# EAGLE design Jetson Breakout (EAGLE 8.6.1)
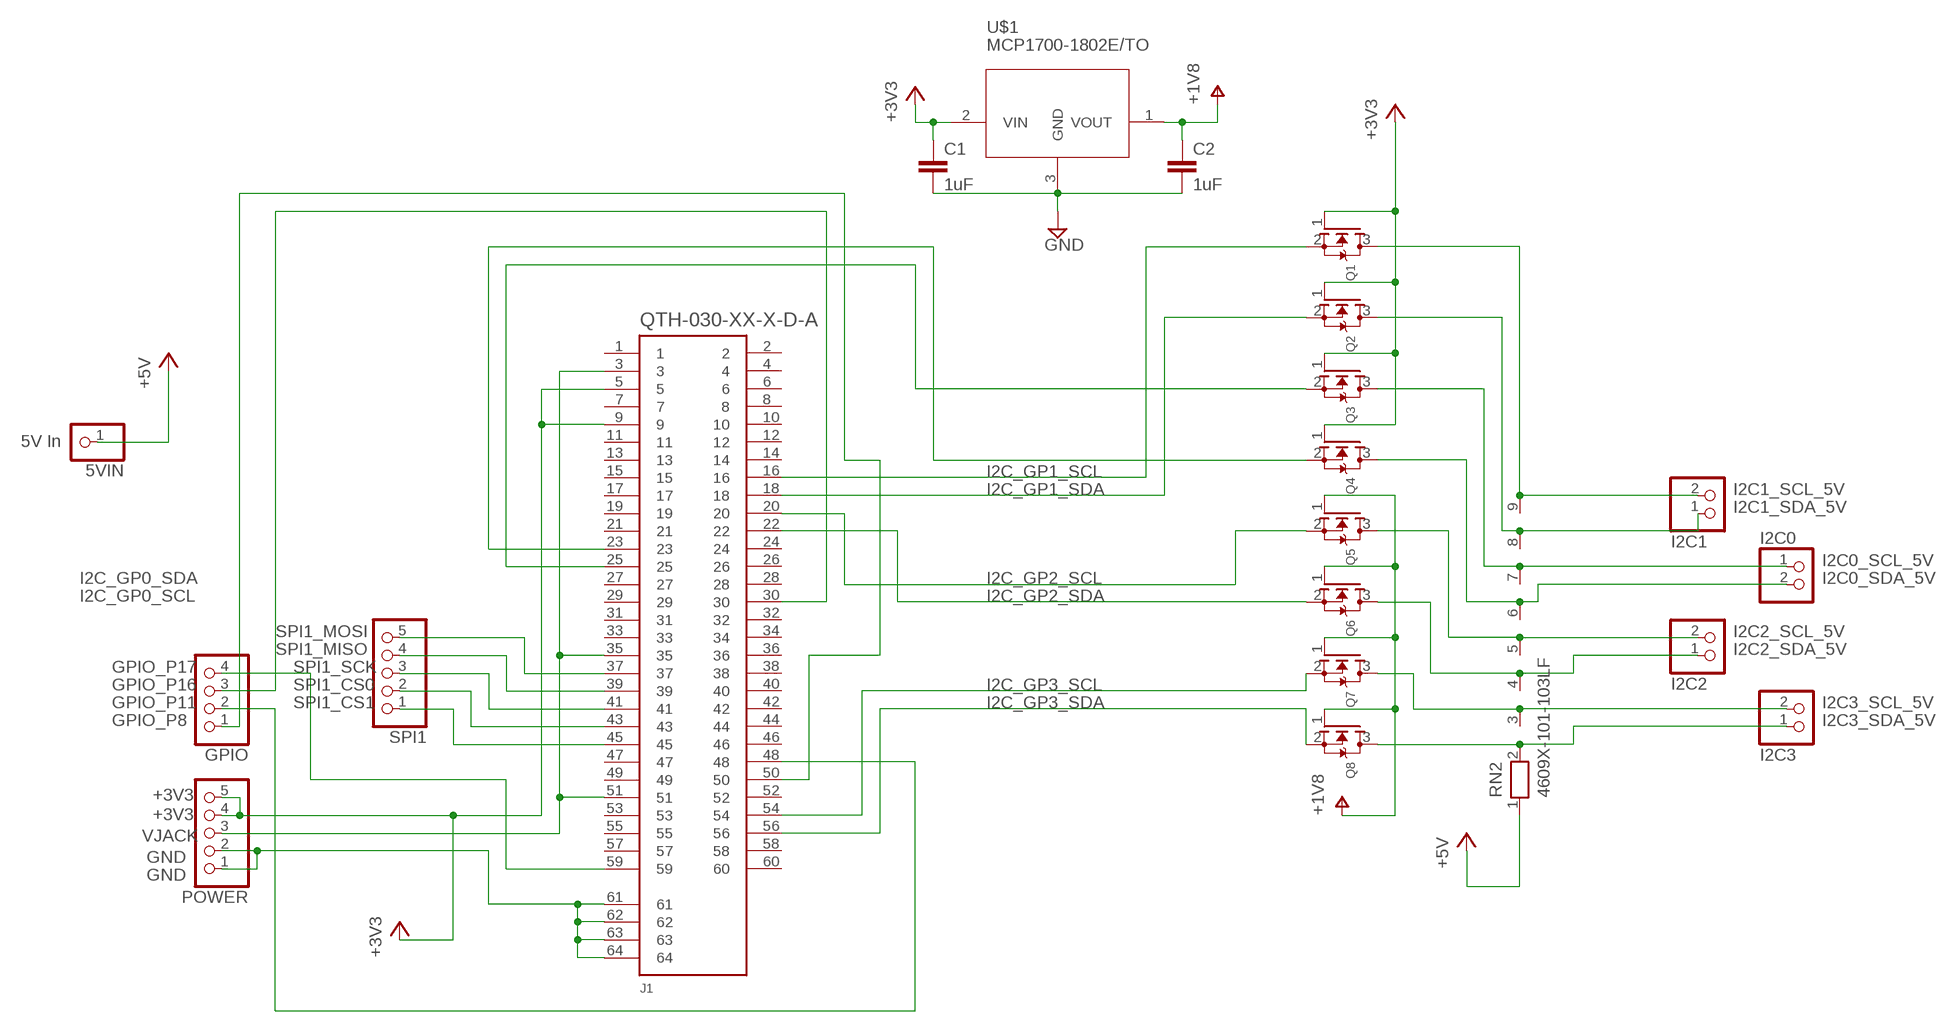
[diagram p0: schematic, sheet 1]

## Parts
5VIN  PINHD-1X1  [1X01]
C1  1uF  C-EU050-025X075  [C050-025X075]
C2  1uF  C-EU050-025X075  [C050-025X075]
GPIO  PINHD-1X4  [1X04]
I2C0  PINHD-1X2  [1X02]
I2C1  PINHD-1X2  [1X02]
I2C2  PINHD-1X2  [1X02]
I2C3  PINHD-1X2  [1X02]
J1  QTH-030-XX-X-D-A  [QTH-030-XX-X-D-A]
POWER  PINHD-1X5  [1X05]
Q1  MOSFET-NREFLOW  [SOT23]
Q2  MOSFET-NREFLOW  [SOT23]
Q3  MOSFET-NREFLOW  [SOT23]
Q4  MOSFET-NREFLOW  [SOT23]
Q5  MOSFET-NREFLOW  [SOT23]
Q6  MOSFET-NREFLOW  [SOT23]
Q7  MOSFET-NREFLOW  [SOT23]
Q8  MOSFET-NREFLOW  [SOT23]
RN2  4609X-101-103LF  RN08  [RN-9]
SPI1  PINHD-1X5  [1X05]
U$1  MCP1700-1802E/TO  [TO92]

## Nets
+1V8: C2.1 Q5.1(G) Q6.1(G) Q7.1(G) Q8.1(G) U$1.1(VOUT)
+3V3: C1.1 J1.5 J1.9 POWER.4 POWER.5 Q1.1(G) Q2.1(G) Q3.1(G) Q4.1(G) U$1.2(VIN)
+5V: 5VIN.1 RN2.1
GND: C1.2 C2.2 J1.61 J1.62 J1.63 J1.64 POWER.1 POWER.2 U$1.3(GND)
GPIO_P8: GPIO.1 J1.50
GPIO_P11: GPIO.2 J1.48
GPIO_P16: GPIO.3 J1.30
GPIO_P17: GPIO.4 J1.59
I2C0_SCL_5V: I2C0.1 Q3.3(D) RN2.7
I2C0_SDA_5V: I2C0.2 Q4.3(D) RN2.6
I2C1_SCL_5V: I2C1.2 Q1.3(D) RN2.9
I2C1_SDA_5V: I2C1.1 Q2.3(D) RN2.8
I2C2_SCL_5V: I2C2.2 Q5.3(D) RN2.5
I2C2_SDA_5V: I2C2.1 Q6.3(D) RN2.4
I2C3_SCL_5V: I2C3.2 Q7.3(D) RN2.3
I2C3_SDA_5V: I2C3.1 Q8.3(D) RN2.2
I2C_GP0_SCL: J1.25 Q3.2(S)
I2C_GP0_SDA: J1.23 Q4.2(S)
I2C_GP1_SCL: J1.16 Q1.2(S)
I2C_GP1_SDA: J1.18 Q2.2(S)
I2C_GP2_SCL: J1.20 Q5.2(S)
I2C_GP2_SDA: J1.22 Q6.2(S)
I2C_GP3_SCL: J1.54 Q7.2(S)
I2C_GP3_SDA: J1.56 Q8.2(S)
SPI1_CS0: J1.43 SPI1.2
SPI1_CS1: J1.45 SPI1.1
SPI1_MISO: J1.39 SPI1.4
SPI1_MOSI: J1.37 SPI1.5
SPI1_SCK: J1.41 SPI1.3
VJACK: J1.3 J1.35 J1.51 POWER.3
Unconnected: J1.1 J1.2 J1.4 J1.6 J1.7 J1.8 J1.10 J1.11 J1.12 J1.13 J1.14 J1.15 J1.17 J1.19 J1.21 J1.24 J1.26 J1.27 J1.28 J1.29 J1.31 J1.32 J1.33 J1.34 J1.36 J1.38 J1.40 J1.42 J1.44 J1.46 J1.47 J1.49 J1.52 J1.53 J1.55 J1.57 J1.58 J1.60

## Notes on the sheet
- 5V In

## Library data of the parts
5VIN = adafruit:PINHD-1X1: Pin header 1x1 for 0.1" spacing With round pins
C1 C2 = rcl:C-EU: CAPACITOR, European symbol; SPICEPREFIX: C
GPIO = pinhead:PINHD-1X4: PIN HEADER
I2C0 I2C1-I2C3 = pinhead:PINHD-1X2: PIN HEADER
J1 = QTH-030-XX-X-D-A:QTH-030-XX-X-D-A: HIGH SPEED TERMINAL STRIP, .5mm PITCH, 60 PINS. MANUFACTURER:SAMTEC.
POWER SPI1 = pinhead:PINHD-1X5: PIN HEADER
Q1-Q8 = adafruit:MOSFET-N: N-Channel Mosfet 2N7002E - 60V 260mA SOT23 [Digikey: 2N7002ET1GOSTR-ND] - REEL BSH103 - 30V 850mA SOT23 [Digikey: 568-5013-1-ND]
RN2 = resistor-net:RN08: RESISTOR NETWORK; OC_FARNELL: unknown; OC_NEWARK: unknown
U$1 = custom:MCP1700-1802E/TO

## Board
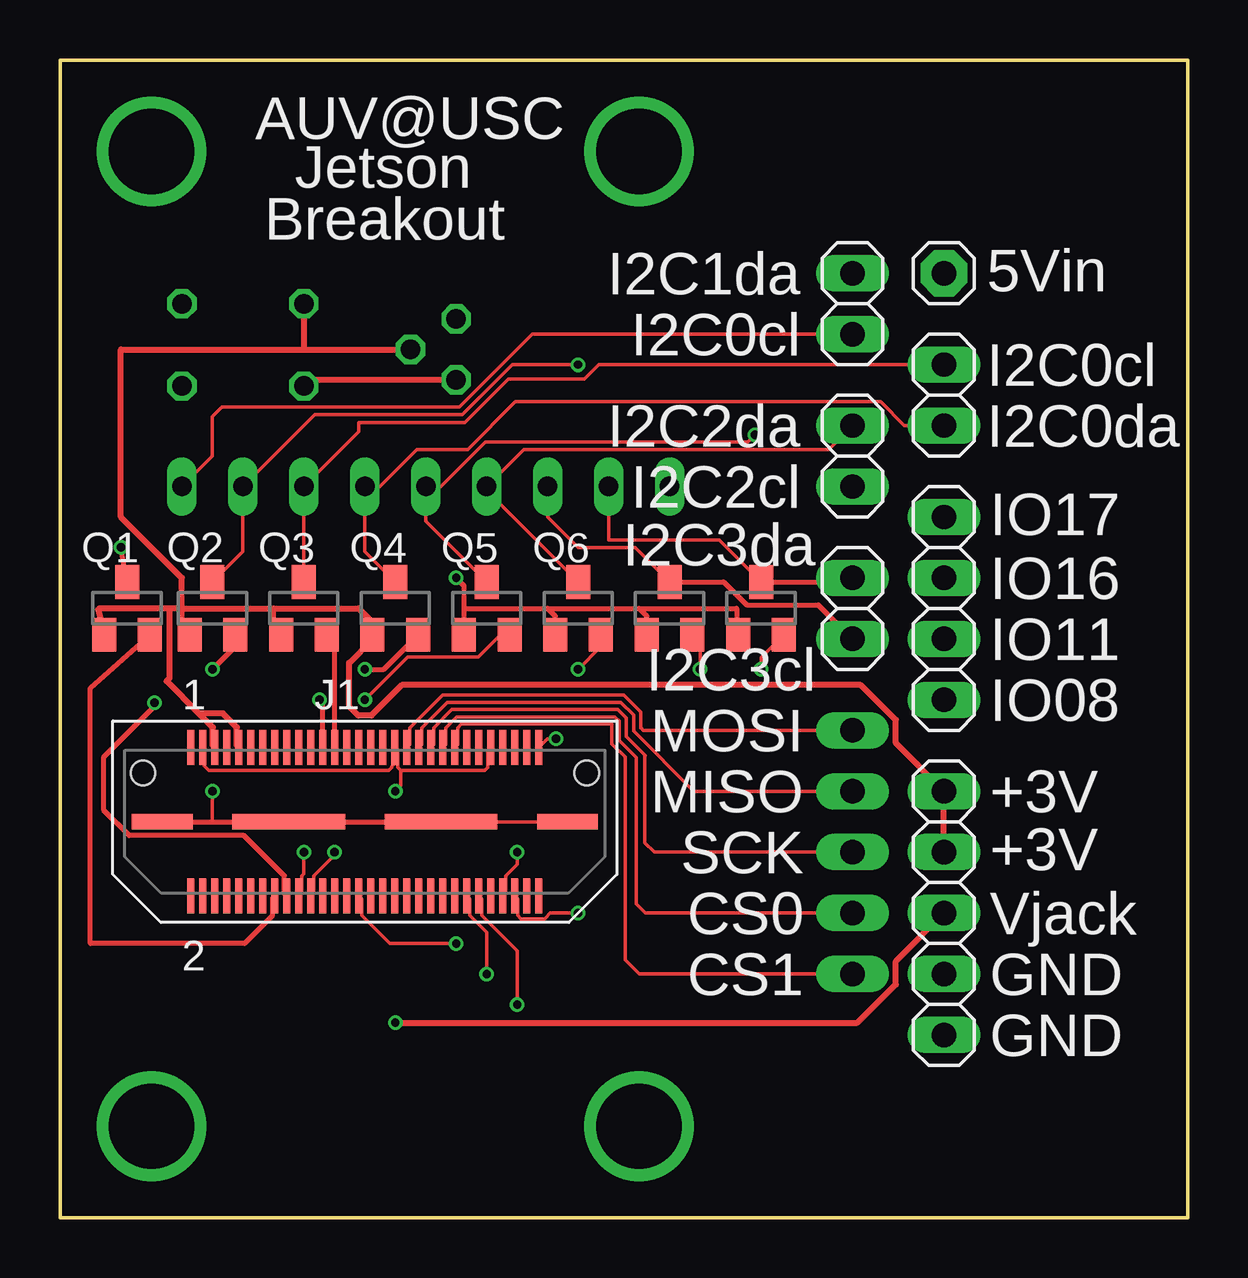
[diagram p1: board, top side]
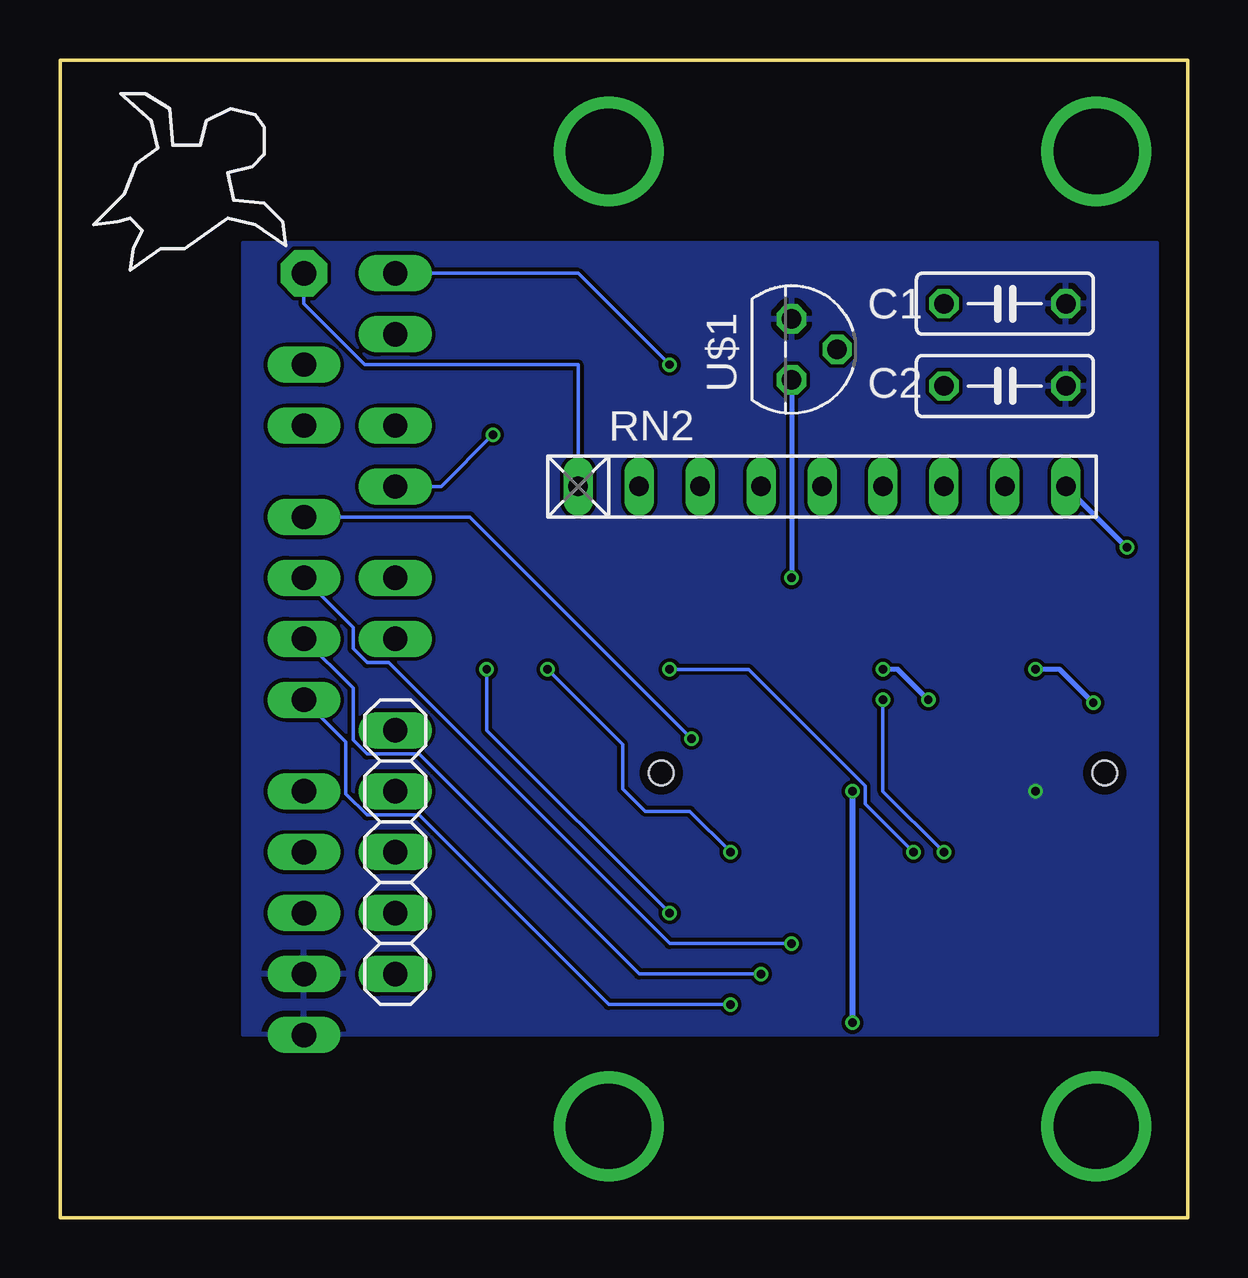
[diagram p2: board, bottom side, seen from below]

Size 46.99 x 48.26 mm. Coordinates in mm from the lower left corner, seen from the top.
Outline: 0,0 46.99,0 46.99,48.26 0,48.26 0,0
Copper layers (1*16): Top 0.035559375mm / dielectric 1.6mm / Bottom 0.035559375mm
Design rules "oshpark-2layer": minimum track width 6mil, minimum drill 10mil, track to track 6mil, track to pad 6mil, pad to pad 6mil, via to via 6mil, smd to smd 6mil, copper to edge 15mil, drill to drill 6mil, minimum pad ring 5mil, minimum via ring 5mil, stop-mask expansion 2.5mil, vias tented up to drill 0mil, thermal gap 10mil

### Footprints (pad centres in the part's own frame; a part is rotated, then mirrored left to right if it is on the bottom)
1X01 = drill 1.016 pad 1.93 octagon: 1 0,0
C050-025X075 = drill 0.813 octagon: 1 -2.54,0; 2 2.54,0
1X04 = drill 1.016 long: 1 -3.81,0; 2 -1.27,0; 3 1.27,0; 4 3.81,0
1X02 = drill 1.016 long: 1 -1.27,0; 2 1.27,0
QTH-030-XX-X-D-A = smd 0.3 x 1.45: 1 -7.255,3.09; 2 -7.255,-3.09; 3 -6.755,3.09; 4 -6.755,-3.09; 5 -6.255,3.09; 6 -6.255,-3.09; 7 -5.755,3.09; 8 -5.755,-3.09; 9 -5.255,3.09; 10 -5.255,-3.09; 11 -4.755,3.09; 12 -4.755,-3.09; 13 -4.255,3.09; 14 -4.255,-3.09; 15 -3.755,3.09; 16 -3.755,-3.09; 17 -3.255,3.09; 18 -3.255,-3.09; 19 -2.755,3.09; 20 -2.755,-3.09; 21 -2.255,3.09; 22 -2.255,-3.09; 23 -1.755,3.09; 24 -1.755,-3.09; 25 -1.255,3.09; 26 -1.255,-3.09; 27 -0.755,3.09; 28 -0.755,-3.09; 29 -0.255,3.09; 30 -0.255,-3.09; 31 0.245,3.09; 32 0.245,-3.09; 33 0.745,3.09; 34 0.745,-3.09; 35 1.245,3.09; 36 1.245,-3.09; 37 1.745,3.09; 38 1.745,-3.09; 39 2.245,3.09; 40 2.245,-3.09; 41 2.745,3.09; 42 2.745,-3.09; 43 3.245,3.09; 44 3.245,-3.09; 45 3.745,3.09; 46 3.745,-3.09; 47 4.245,3.09; 48 4.245,-3.09; 49 4.745,3.09; 50 4.745,-3.09; 51 5.245,3.09; 52 5.245,-3.09; 53 5.745,3.09; 54 5.745,-3.09; 55 6.245,3.09; 56 6.245,-3.09; 57 6.745,3.09; 58 6.745,-3.09; 59 7.245,3.09; 60 7.245,-3.09 | smd 2.54 x 0.64: 61 -8.445,0; 64 8.445,0 | smd 4.7 x 0.64: 62 -3.175,0; 63 3.175,0 | hole 1.02: -9.24,2.03; 9.24,2.03
1X05 = drill 1.016 long: 1 -5.08,0; 2 -2.54,0; 3 0,0; 4 2.54,0; 5 5.08,0
SOT23 = smd 1 x 1.4: 1 -0.95,-1.1; 2 0.95,-1.1; 3 0,1.1
RN-9 = drill 0.813 long: 1 -10.16,0; 2 -7.62,0; 3 -5.08,0; 4 -2.54,0; 5 0,0; 6 2.54,0; 7 5.08,0; 8 7.62,0; 9 10.16,0
TO92 = drill 0.813 octagon: 1 1.27,0; 2 0,1.905; 3 -1.27,0

### Placement (x,y rotation side)
5VIN  36.83,39.37 270 top
C1  7.62,38.1 0 bottom
C2  7.62,34.67 0 bottom
GPIO  36.83,25.4 90 top
I2C0  36.83,34.29 270 top
I2C1  33.02,38.1 270 top
I2C2  33.02,31.75 270 top
I2C3  33.02,25.4 270 top
J1  12.7,16.51 0 top
POWER  36.83,12.7 90 top
Q1  2.79,25.4 0 top
Q2  6.35,25.4 0 top
Q3  10.16,25.4 0 top
Q4  13.97,25.4 0 top
Q5  17.78,25.4 0 top
Q6  21.59,25.4 0 top
Q7  25.4,25.4 0 top
Q8  29.21,25.4 0 top
RN2  15.24,30.48 0 bottom
SPI1  33.02,15.24 90 bottom
U$1  16.51,36.2 270 bottom

### Tracks (layer width: path | path; a pad name or v marks a point on that pad's centre or on a via)
+1V8  (via drill 0.35)
  Top 0.203: v16.51,26.67 16.83,26.35 16.83,25.4 | 16.83,25.4 Q5.1 | 16.83,25.4 20.32,25.4 | 20.32,25.4 24.13,25.4 | 24.13,25.4 28.19,25.4 28.19,24.37 Q8.1 | Q7.1 24.45,25.08 24.13,25.4 | Q6.1 20.64,25.08 20.32,25.4
  Top 0.254: U$1.1 10.41,34.92 C2.1
  Bottom 0.203: U$1.1 v16.51,26.67
+3V3
  Top 0.254: J1.5 6.37,19.67 6.37,20.44 5.79,21.03 | 5.79,21.03 4.45,22.37 4.57,22.5 4.57,25.4 | 10.16,36.2 2.54,36.2 2.54,29.21 5.08,26.67 5.08,25.4 | 10.16,36.2 U$1.2 | C1.1 10.16,36.2 | 5.08,25.4 4.57,25.4 | 4.57,25.4 1.65,25.4 1.59,25.34 Q1.1 | 5.08,25.4 8.89,25.4 | 8.89,25.4 12.45,25.4 13.02,24.83 Q4.1 13.02,24.11 12.04,23.13 12.04,21.32 12.43,20.93 12.97,20.93 14.24,22.2 33.37,22.2 34.82,20.75 34.82,19.79 POWER.5 POWER.4 | Q3.1 8.89,24.62 8.89,25.4 | Q2.1 5.08,24.62 5.08,25.4 | J1.9 7.37,19.67 7.37,20.44 6.79,21.03 5.79,21.03
+5V
  Bottom 0.152: 5VIN.1 36.83,38.1 34.29,35.56 25.4,35.56 RN2.1
GND  (via drill 0.35)
  Top 0.152: J1.63 J1.64 | 6.35,16.51 v6.35,17.78 | J1.62 7.62,16.51
  Top 0.2: J1.61 6.35,16.51 7.62,16.51 J1.63
  pour Bottom: 1.27,7.62 39.37,7.62 39.37,40.64 1.27,40.64
GPIO_P8  (via drill 0.35)
  Top 0.152: J1.50 17.57,13.3 17.57,12.6 19.05,11.12 v19.05,8.89
  Bottom 0.152: v19.05,8.89 24.13,8.89 32.03,16.79 34.19,16.79 35.08,17.67 35.08,19.84 GPIO.1
GPIO_P11  (via drill 0.35)
  Top 0.152: J1.48 17.07,13.3 17.07,12.6 17.78,11.89 v17.78,10.16
  Bottom 0.152: v17.78,10.16 22.86,10.16 32.03,19.33 34.19,19.33 34.77,19.91 34.77,22.07 GPIO.2
GPIO_P16  (via drill 0.35)
  Top 0.152: J1.30 12.57,13.3 12.57,12.6 13.74,11.43 v16.51,11.43
  Bottom 0.152: v16.51,11.43 21.59,11.43 33.3,23.14 34.19,23.14 34.77,23.72 34.77,24.61 GPIO.3
GPIO_P17  (via drill 0.35)
  Top 0.152: J1.59 20.31,19.97 v20.67,19.97
  Bottom 0.152: v20.67,19.97 29.92,29.21 GPIO.4
I2C0_SCL_5V
  Top 0.152: Q3.3 RN2.7 12.45,32.77 12.45,33.15 16.86,33.15 18.67,34.95 21.84,34.95 22.45,35.56 22.86,35.56 I2C0.1
I2C0_SDA_5V
  Top 0.152: Q4.3 12.7,27.77 RN2.6 13.32,30.48 14.87,32.03 16.98,32.03 18.96,34.01 34.19,34.01 35.18,33.02 I2C0.2
I2C1_SCL_5V  (via drill 0.35)
  Top 0.152: RN2.9 6.35,31.75 6.35,33.4 6.73,33.78 16.64,33.78 19.68,36.83 I2C1.2
  Top 0.203: Q1.3 v2.54,27.94
  Bottom 0.203: v2.54,27.94 RN2.9
I2C1_SDA_5V  (via drill 0.35)
  Top 0.152: Q2.3 7.62,27.77 RN2.8 10.62,33.48 16.76,33.48 18.85,35.56 v21.59,35.56
  Bottom 0.152: v21.59,35.56 25.4,39.37 I2C1.1
I2C2_SCL_5V  (via drill 0.35)
  Top 0.152: Q5.3 15.24,29.04 RN2.5 15.86,30.48 17.72,32.33 28.65,32.33 v28.96,32.64
  Bottom 0.152: v28.96,32.64 31.11,30.48 I2C2.2
I2C2_SDA_5V
  Top 0.152: Q6.3 17.78,30.31 RN2.4 19.33,32.03 32.03,32.03 I2C2.1
I2C3_SCL_5V
  Top 0.152: Q7.3 23.96,27.94 21.59,27.94 20.32,29.21 RN2.3
  Top 0.203: Q7.3 27.65,26.5 28.61,25.55 31.6,25.55 I2C3.2
I2C3_SDA_5V
  Top 0.152: Q8.3 27.46,28.24 22.86,28.24 RN2.2
  Top 0.203: Q8.3 32.85,26.5 I2C3.1
I2C_GP0_SCL
  Top 0.203: J1.25 11.45,23.97 Q3.2
I2C_GP0_SDA  (via drill 0.35)
  Top 0.203: J1.23 10.95,21.46 v10.81,21.59 | v12.7,22.86 13.48,22.86 Q4.2
  Bottom 0.203: v10.81,21.59 12.08,22.86 v12.7,22.86
I2C_GP1_SCL
  Top 0.203: J1.16 8.85,13.32 8.85,12.59 7.69,11.43 1.27,11.43 1.27,22.08 Q1.2
I2C_GP1_SDA  (via drill 0.35)
  Top 0.203: J1.18 9.35,13.52 9.35,14.25 7.66,15.94 2.88,15.94 1.83,16.98 1.83,19.21 3.94,21.32 v3.94,21.46 | v6.35,22.86 7.3,23.81 Q2.2
  Bottom 0.203: v3.94,21.46 5.33,22.86 v6.35,22.86
I2C_GP2_SCL  (via drill 0.35)
  Top 0.152: J1.20 10.07,13.54 10.07,14.24 10.16,14.33 v10.16,15.24 | Q5.2 18.35,24.3 17.43,23.37 14.48,23.37 v12.7,21.59
  Bottom 0.152: v10.16,15.24 12.7,17.78 v12.7,21.59
I2C_GP2_SDA  (via drill 0.35)
  Top 0.152: J1.22 10.57,13.54 10.57,14.24 11.43,15.1 v11.43,15.24 | v21.59,22.86 22.54,23.81 Q6.2
  Bottom 0.152: v11.43,15.24 13.44,17.25 13.44,18 18.3,22.86 v21.59,22.86
I2C_GP3_SCL  (via drill 0.35)
  Top 0.152: J1.54 18.57,13.54 18.57,14.24 19.05,14.72 v19.05,15.24 | v26.67,22.86 26.67,23.98 Q7.2
  Bottom 0.152: v19.05,15.24 20.75,16.94 22.6,16.94 23.54,17.88 23.54,19.73 v26.67,22.86
I2C_GP3_SDA  (via drill 0.35)
  Top 0.152: J1.56 19.07,13.3 19.07,12.6 19.2,12.47 20.19,12.47 20.42,12.7 v21.59,12.7 | v29.21,22.86 29.21,23.35 Q8.2
  Bottom 0.152: v21.59,12.7 29.21,20.32 v29.21,22.86
N$1  (via drill 3.56)
  other vias: 3.81,44.45
N$2  (via drill 3.56)
  other vias: 24.13,44.45
N$3  (via drill 3.56)
  other vias: 24.13,3.81
N$4  (via drill 3.56)
  other vias: 3.81,3.81
SPI1_CS0
  Top 0.152: J1.43 16.07,19.72 16.07,20.42 16.53,20.88 23.11,20.88 23.29,20.7 23.29,19.89 24,19.18 24,13.08 24.26,12.83 24.38,12.7 SPI1.2
SPI1_CS1
  Top 0.152: J1.45 16.57,19.72 16.57,20.42 16.72,20.57 22.99,20.57 22.99,19.76 23.54,19.2 23.54,10.75 24.13,10.16 SPI1.1
SPI1_MISO
  Top 0.152: J1.39 15.07,19.72 15.07,20.42 16.14,21.49 23.37,21.49 23.9,20.95 23.9,20.3 26.42,17.78 SPI1.4
SPI1_MOSI
  Top 0.152: J1.37 14.57,19.72 14.57,20.42 15.94,21.79 23.49,21.79 24.21,21.08 24.21,20.42 24.22,20.41 24.31,20.32 SPI1.5
SPI1_SCK
  Top 0.152: J1.41 15.57,19.72 15.57,20.42 16.33,21.18 23.24,21.18 23.6,20.83 23.6,20.07 24.37,19.29 | 24.37,19.29 24.38,19.28 | 24.37,19.29 24.37,15.63 24.77,15.24 SPI1.3
VJACK  (via drill 0.35)
  Top 0.152: 14.2,18.65 14.07,18.78 14.07,19.05 | J1.51 17.82,19.48 17.82,18.78 17.69,18.65 14.2,18.65 | 14.07,19.05 14.07,19.48 J1.35 | 34.77,10.64 POWER.3 | v13.97,17.78 14.2,18.01 14.2,18.65 | J1.3 6.02,19.53 6.02,18.83 6.2,18.65 13.69,18.65 13.82,18.78 13.82,18.81 14.07,19.05
  Top 0.254: POWER.3 34.82,10.69 34.82,9.73 33.22,8.13 v13.97,8.13
  Bottom 0.254: v13.97,17.78 v13.97,8.13

### Text on the board
tPlace: AUV@USC | Jetson | Breakout | I2C1da | 5Vin | I2C0cl | I2C0cl | I2C2da | I2C0da | I2C2cl | I2C3da | IO17 | IO16 | I2C3cl | IO11 | IO08 | MOSI | MISO | +3V | SCK | +3V | CS0 | Vjack | CS1 | GND | GND